# Altium project Clamp_preamp.PrjPcb
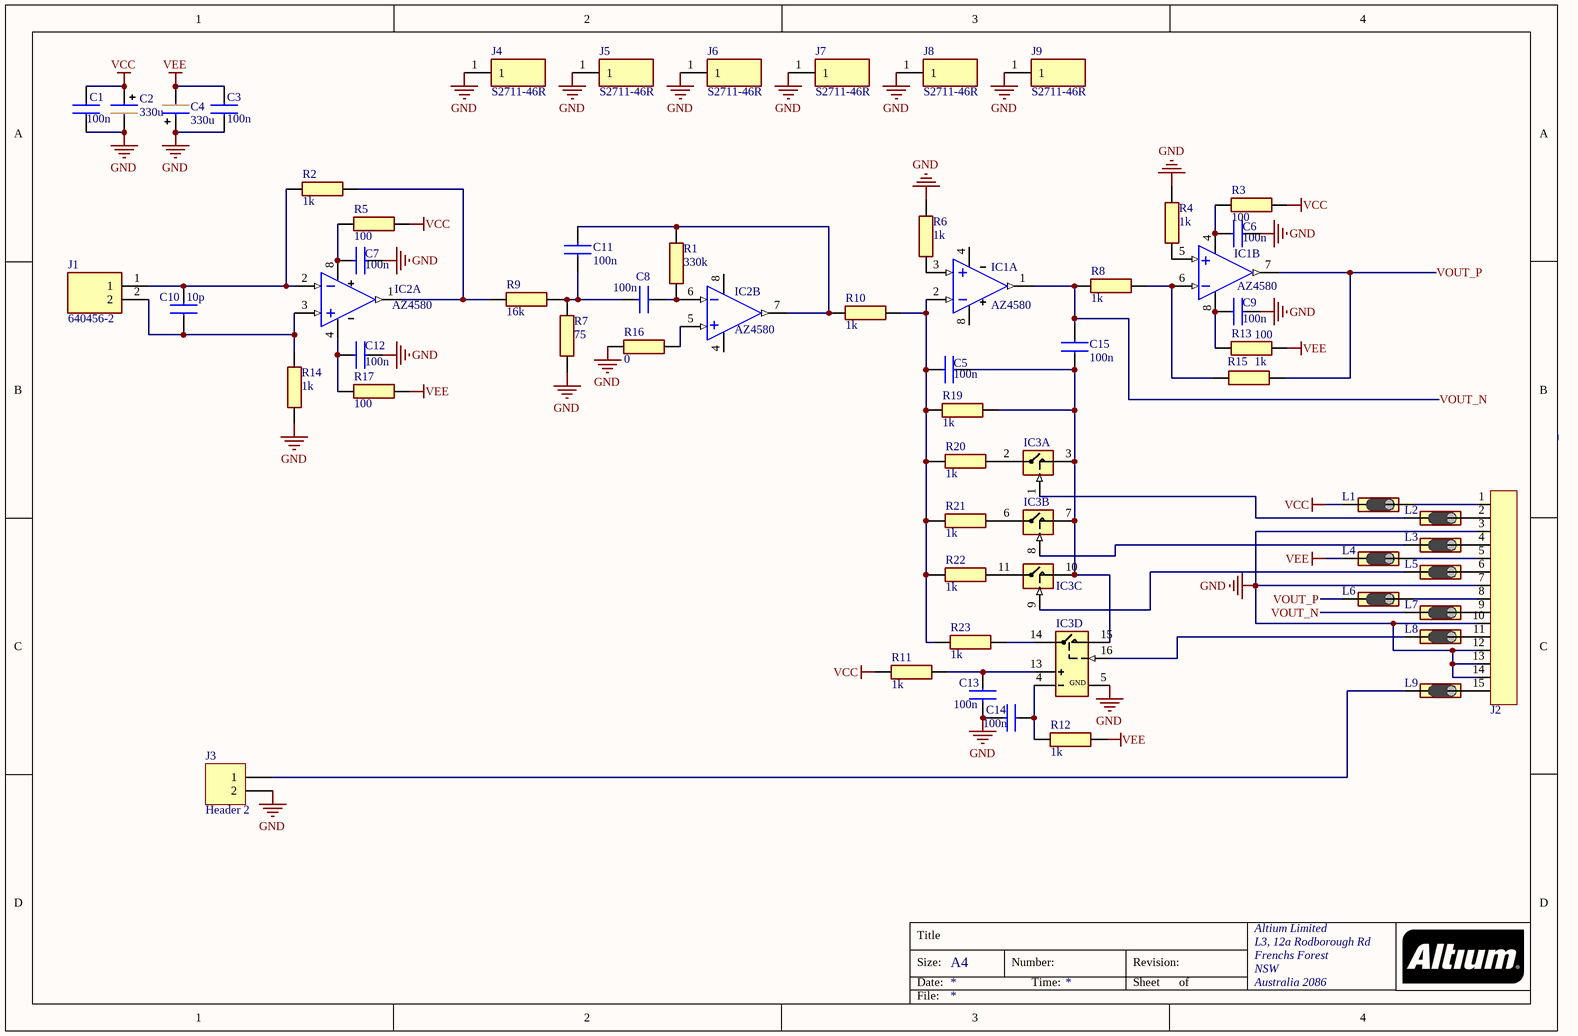
[diagram p0: Sensor.SchDoc]
1 sheet, 58 parts. Net scope: global (net labels, ports and power ports of the same name join across sheets).
Board file: Sensor.PcbDoc

## Sheet Sensor.SchDoc
size A4; Organization: Altium Limited; Address1: L3, 12a Rodborough Rd; Address2: Frenchs Forest; Address3: NSW; Address4: Australia 2086

### Parts
C1  value 100n  [CAPC2012X140N]  (hidden comment: Capacitor_SMD)
C2  value 330u  [CAP_EL_8X12R3_5]  (hidden comment: Capacitor Electrolytic)
C3  value 100n  [CAPC2012X140N]  (hidden comment: Capacitor_SMD)
C4  value 330u  [CAP_EL_8X12R3_5]  (hidden comment: Capacitor Electrolytic)
C5  value 100n  [CAPC2012X140N]  (hidden comment: Capacitor_SMD)
C6  value 100n  [CAPC2012X140N]  (hidden comment: Capacitor_SMD)
C7  value 100n  [CAPC2012X140N]  (hidden comment: Capacitor_SMD)
C8  value 100n  [CAPC3216X95N]  (hidden comment: Capacitor_SMD)
C9  value 100n  [CAPC2012X140N]  (hidden comment: Capacitor_SMD)
C10  value 10p  [CAPC2012X140N]  (hidden comment: Capacitor_SMD)
C11  value 100n  [CAPC3216X95N]  (hidden comment: Capacitor_SMD)
C12  value 100n  [CAPC2012X140N]  (hidden comment: Capacitor_SMD)
C13  value 100n  [CAPC2012X140N]  (hidden comment: Capacitor_SMD)
C14  value 100n  [CAPC2012X140N]  (hidden comment: Capacitor_SMD)
C15  value 100n  [CAPC3216X95N]  (hidden comment: Capacitor_SMD)
IC1  AZ4580  [SOP65P490X110-8N]  (parts A,B of 2)
IC2  AZ4580  [SOP65P490X110-8N]  (parts A,B of 2)
IC3  DG442DY-E3  [SOIC127P600X175-16N]  (value not drawn)  (parts A,B,C,D of 4)
J1  640456-2  [SHDR2W66P0X254_1X2_508X572X1041P]
J2  D-Sub 15 pin  [ICD15S13E4GV00LF]  (value not drawn)
J3  Header 2  [HDR1X2]
J4  S2711-46R  [S271146R]
J5  S2711-46R  [S271146R]
J6  S2711-46R  [S271146R]
J7  S2711-46R  [S271146R]
J8  S2711-46R  [S271146R]
J9  S2711-46R  [S271146R]
L1  Ferrite Bead  [RESC2012X60N]  (value not drawn)
L2  Ferrite Bead  [RESC2012X60N]  (value not drawn)
L3  Ferrite Bead  [RESC2012X60N]  (value not drawn)
L4  Ferrite Bead  [RESC2012X60N]  (value not drawn)
L5  Ferrite Bead  [RESC2012X60N]  (value not drawn)
L6  Ferrite Bead  [RESC2012X60N]  (value not drawn)
L7  Ferrite Bead  [RESC2012X60N]  (value not drawn)
L8  Ferrite Bead  [RESC2012X60N]  (value not drawn)
L9  Ferrite Bead  [RESC2012X60N]  (value not drawn)
R1  value 330k  [RESC2012X60N]  (hidden comment: Res_SMD)
R2  value 1k  [RESC2012X60N]  (hidden comment: Res_SMD)
R3  value 100  [RESC2012X60N]  (hidden comment: Res_SMD)
R4  value 1k  [RESC2012X60N]  (hidden comment: Res_SMD)
R5  value 100  [RESC2012X60N]  (hidden comment: Res_SMD)
R6  value 1k  [RESC2012X60N]  (hidden comment: Res_SMD)
R7  value 75  [RESC2012X60N]  (hidden comment: Res_SMD)
R8  value 1k  [RESC2012X60N]  (hidden comment: Res_SMD)
R9  value 16k  [RESC2012X60N]  (hidden comment: Res_SMD)
R10  value 1k  [RESC2012X60N]  (hidden comment: Res_SMD)
R11  value 1k  [RESC2012X60N]  (hidden comment: Res_SMD)
R12  value 1k  [RESC2012X60N]  (hidden comment: Res_SMD)
R13  value 100  [RESC2012X60N]  (hidden comment: Res_SMD)
R14  value 1k  [RESC2012X60N]  (hidden comment: Res_SMD)
R15  value 1k  [RESC2012X60N]  (hidden comment: Res_SMD)
R16  value 0  [RESC2012X60N]  (hidden comment: Res_SMD)
R17  value 100  [RESC2012X60N]  (hidden comment: Res_SMD)
R19  value 1k  [RESC2012X60N]  (hidden comment: Res_SMD)
R20  value 1k  [RESC2012X60N]  (hidden comment: Res_SMD)
R21  value 1k  [RESC2012X60N]  (hidden comment: Res_SMD)
R22  value 1k  [RESC2012X60N]  (hidden comment: Res_SMD)
R23  value 1k  [RESC2012X60N]  (hidden comment: Res_SMD)

### Nets
GND: C1.2 C2.2(-) C3.2 C4.1(+) C6.1 C7.1 C9.1 C12.1 C13.2 C14.1 IC3.5(GND) J2.3 J2.7 J2.10 J2.12 J2.13 J2.14 J3.2 J4.1 J5.1 J6.1 J7.1 J8.1 J9.1 R4.1 R6.1 R7.1 R14.1 R16.1
VCC: C1.1 C2.1(+) L1.1 R3.1 R5.1 R11.1
VEE: C3.1 C4.2(-) L4.1 R12.2 R13.1 R17.1
VOUT_N: C15.1 IC1.1(OUT) L7.1 R8.2
VOUT_P: IC1.7(OUT) L6.1 R15.1
NetC5_1: C5.1 C15.2 IC3.3(S1) IC3.7(D4) IC3.10(D3) IC3.15(D2) R19.2
NetC5_2: C5.2 IC1.2(IN-) R10.2 R19.1 R20.1 R21.1 R22.1 R23.1
NetC6_2: C6.2 IC1.4(V-) R3.2
NetC7_2: C7.2 IC2.8(V+) R5.2
NetC8_1: C8.1 C11.1 R7.2 R9.2
NetC8_2: C8.2 IC2.6(IN-) R1.1
NetC9_2: C9.2 IC1.8(V+) R13.2
NetC10_1: C10.1 IC2.2(IN-) J1.1 R2.1
NetC10_2: C10.2 IC2.3(IN+) J1.2 R14.2
NetC11_2: C11.2 IC2.7(OUT) R1.2 R10.1
NetC12_2: C12.2 IC2.4(V-) R17.2
NetC13_1: C13.1 IC3.13(V+) R11.2
NetC14_2: C14.2 IC3.4(V-) R12.1
NetIC1_3: IC1.3(IN+) R6.2
NetIC1_5: IC1.5(IN+) R4.2
NetIC1_6: IC1.6(IN-) R8.1 R15.2
NetIC2_1: IC2.1(OUT) R2.2 R9.1
NetIC2_5: IC2.5(IN+) R16.2
NetIC3_1: IC3.1(IN1) L2.1
NetIC3_2: IC3.2(D1) R20.2
NetIC3_6: IC3.6(S4) R21.2
NetIC3_8: IC3.8(IN4) L3.1
NetIC3_9: IC3.9(IN3) L5.1
NetIC3_11: IC3.11(S3) R22.2
NetIC3_14: IC3.14(S2) R23.2
NetIC3_16: IC3.16(IN2) L8.1
NetJ2_1: J2.1 L1.2
NetJ2_2: J2.2 L2.2
NetJ2_4: J2.4 L3.2
NetJ2_5: J2.5 L4.2
NetJ2_6: J2.6 L5.2
NetJ2_8: J2.8 L6.2
NetJ2_9: J2.9 L7.2
NetJ2_11: J2.11 L8.2
NetJ2_15: J2.15 L9.2
NetJ3_1: J3.1 L9.1

### Notes on the sheet
- Title
- Size:
- Date:
- A4
- Number:
- Time:
- Revision:
- Sheet
- of
- File:

### Library data of the parts
C1 C3 C5-C15 = Capacitor_SMD: Capacitor smd ceramic; Manufacturer_Name: TDK; Manufacturer_Part_Number: C3216C0G1H562J060AA; Datasheet Link: https://product.tdk.com/info/en/catalog/datasheets/mlcc_commercial_midvoltage_en.pdf; Height: 0.75mm
C2 C4 = Capacitor Electrolytic: Capacitor polarized electrolytic; Manufacturer_Name: TDK; Manufacturer_Part_Number: B43640A9477M; Datasheet Link: https://componentsearchengine.com/Datasheets/1/B43640A9477M.pdf; Height: 52mm; Mouser Part Number: 871-B43640A9477M
IC1 IC2 = AZ4580: Operational amplifier; Arrow Part Number: AZ4580
IC3 = DG442DY-E3: Integrated Circuit; Manufacturer_Name: Vishay; Datasheet Link: http://www.vishay.com/docs/70053/dg441.pdf; Height: 1.75mm; Manufacturer_Part_Number: DG442DY-E3; Mouser Part Number: 781-DG442DY-E3; Mouser Price/Stock: https://www.mouser.com/Search/Refine.aspx?Keyword=781-DG442DY-E3; Arrow Part Number: DG442DY-E3; Arrow Price/Stock: https://www.arrow.com/en/products/dg442dy-e3/vishay
J1 = 640456-2: Connector; Manufacturer_Name: TE Connectivity; Datasheet Link: http://www.te.com/commerce/DocumentDelivery/DDEController?Action=showdoc&DocId=Customer+Drawing%7F640456%7FW3%7Fpdf%7FEnglish%7FENG_CD_640456_W3.pdf%7F640456-2; Height: 10.414mm; Manufacturer_Part_Number: 640456-2; Mouser Part Number: 571-6404562; Mouser Price/Stock: https://www.mouser.co.uk/ProductDetail/TE-Connectivity-AMP/640456-2?qs=%2F35zJ5USjomRu3EJQJgZCQ%3D%3D; Arrow Part Number: 640456-2; Arrow Price/Stock: https://www.arrow.com/en/products/640456-2/te-connectivity
J2 = D-Sub 15 pin: Connector D sub 9 pin pcb angled 90; Manufacturer_Name: Amphenol; Datasheet Link: https://www.amphenol-icc.com/media/wysiwyg/files/drawing/c-cd-0012.pdf; Height: 12.96mm; Manufacturer_Part_Number: ICD15S13E4GV00LF; Mouser Part Number: 649-ICD15S13E4GV00LF; Mouser Price/Stock: https://www.mouser.co.uk/ProductDetail/Amphenol-FCI/ICD15S13E4GV00LF?qs=XRaITl65jntmDA26LPPFrA%3D%3D; Arrow Part Number: ICD15S13E4GV00LF; Arrow Price/Stock: https://www.arrow.com/en/products/icd15s13e4gv00lf/amphenol-fci; System: Connector
J3 = Header 2: Header, 2-Pin; LatestRevisionDate: 17-Jul-2002; LatestRevisionNote: Re-released for DXP Platform.; Publisher: Altium Limited
J4-J9 = S2711-46R: Connector; Manufacturer_Name: Harwin; Datasheet Link: https://cdn.harwin.com/pdfs/S2711-XXR.pdf; Height: 3.55mm; Manufacturer_Part_Number: S2711-46R; Mouser Part Number: 855-S2711-46R; Mouser Price/Stock: https://www.mouser.co.uk/ProductDetail/Harwin/S2711-46R?qs=93uzuGORGqcNzTm67lIH2g%3D%3D
L1-L9 = Ferrite Bead: Bead ferrite
R1-R17 R19-R23 = Res_SMD: Resistor SMD; Manufacturer_Name: Bourns; Manufacturer_Part_Number: CR1206-FW-1504ELF; Datasheet Link: http://componentsearchengine.com/Datasheets/1/CR1206-FW-1504ELF.pdf; Height: 0.75mm; Mouser Part Number: 652-CR1206FW1504ELF; Mouser Price/Stock: https://www.mouser.co.uk/ProductDetail/Bourns/CR1206-FW-1504ELF/?qs=6oMev5NRZMFfvXkOpYL2%252BA%3D%3D; Arrow Part Number: CR1206-FW-1504ELF; Arrow Price/Stock: https://www.arrow.com/en/products/cr1206-fw-1504elf/bourns